# EAGLE design RPi-Camera-RingLicht_v10 (EAGLE 7.5.0)
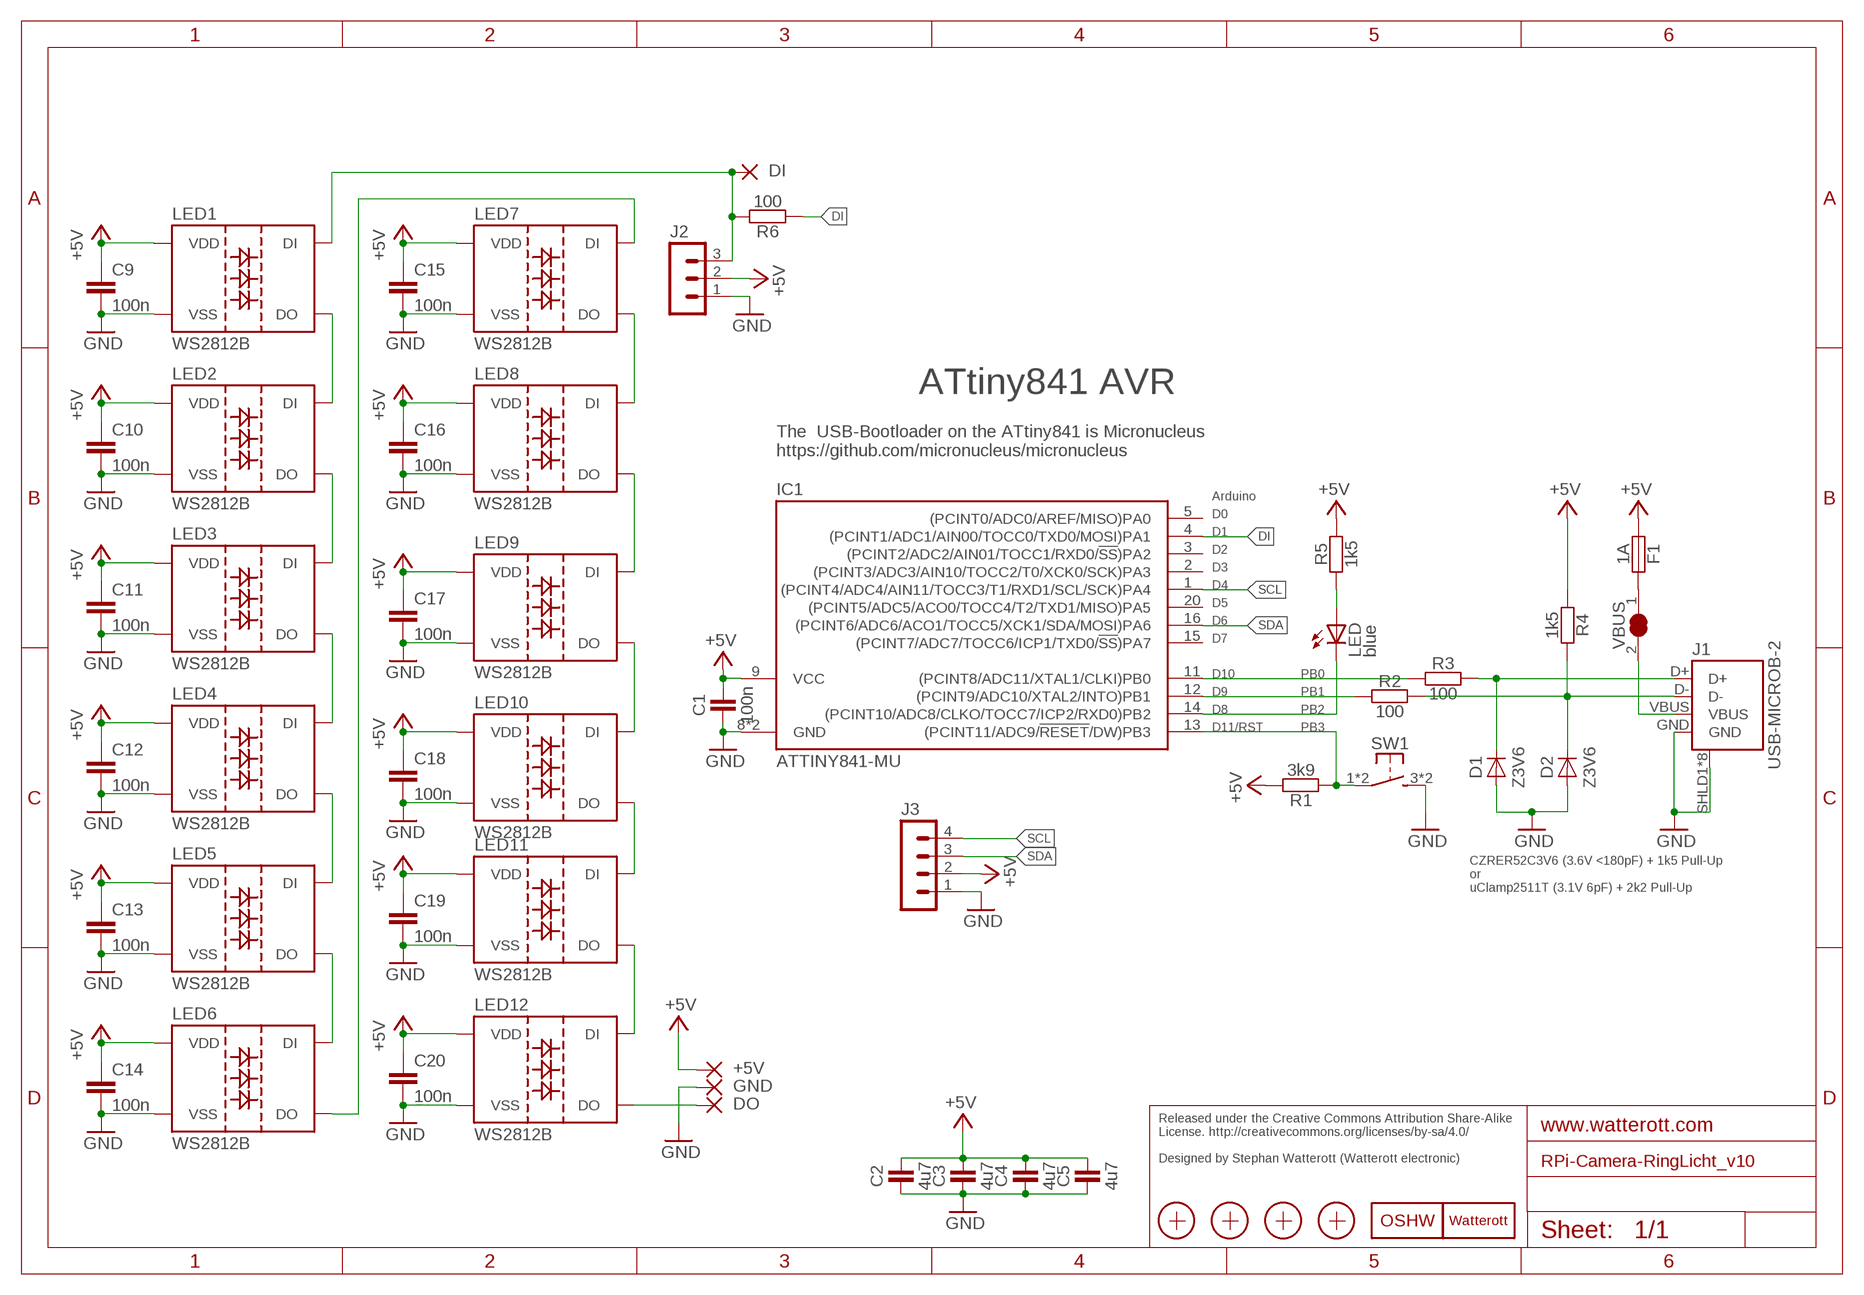
[diagram p0: schematic, sheet 1]

## Parts
+5V  SMD2  [SMD1,27-2,54]
C1  100n  CAPACITOR-0402  [C0402]
C2  4u7  CAPACITOR-0402  [C0402]
C3  4u7  CAPACITOR-0402  [C0402]
C4  4u7  CAPACITOR-0402  [C0402]
C5  4u7  CAPACITOR-0402  [C0402]
C9  100n  C-EUC0402K  [C0402K]
C10  100n  C-EUC0402K  [C0402K]
C11  100n  C-EUC0402K  [C0402K]
C12  100n  C-EUC0402K  [C0402K]
C13  100n  C-EUC0402K  [C0402K]
C14  100n  C-EUC0402K  [C0402K]
C15  100n  C-EUC0402K  [C0402K]
C16  100n  C-EUC0402K  [C0402K]
C17  100n  C-EUC0402K  [C0402K]
C18  100n  C-EUC0402K  [C0402K]
C19  100n  C-EUC0402K  [C0402K]
C20  100n  C-EUC0402K  [C0402K]
D1  Z3V6  DIODE-SOD882  [SOD882]
D2  Z3V6  DIODE-SOD882  [SOD882]
DI  SMD2  [SMD1,27-2,54]
DO  SMD2  [SMD1,27-2,54]
F1  1A  FUSE-0805  [C0805]
GND  SMD2  [SMD1,27-2,54]
IC1  ATTINY841-MU  [QFN20-PAD]
J1  USB-MICROB-2  [USB-MICROB-10118194]
J2  JST3-S3B-PH-SM4-TB  [JST_S3B-PH-SM4-TB]
J3  JST4-S4B-PH-SM4-TB  [JST_S4B-PH-SM4-TB]
LED  blue  LED-0603  [C0603]
LED1  WS2812B  [WS2812B]
LED2  WS2812B  [WS2812B]
LED3  WS2812B  [WS2812B]
LED4  WS2812B  [WS2812B]
LED5  WS2812B  [WS2812B]
LED6  WS2812B  [WS2812B]
LED7  WS2812B  [WS2812B]
LED8  WS2812B  [WS2812B]
LED9  WS2812B  [WS2812B]
LED10  WS2812B  [WS2812B]
LED11  WS2812B  [WS2812B]
LED12  WS2812B  [WS2812B]
LOGO1  LOGO-S_PLACE_M  [SPARK_TPLACE_M]
LOGO2  OSHW_LOGOX0070  [OSHW_6X70]
R1  3k9  RESISTOR-0402  [C0402]
R2  100  RESISTOR-0402  [C0402]
R3  100  RESISTOR-0402  [C0402]
R4  1k5  RESISTOR-0402  [C0402]
R5  1k5  RESISTOR-0402  [C0402]
R6  100  RESISTOR-0402  [C0402]
SW1  SW-TACTILE-PTS840P  [PTS840P]
VBUS  JUMPER2-0603-NC  [JUMPER2-0603_NC]
X1  PASSER-07  [PASSER_07MM]
X2  PASSER-07  [PASSER_07MM]
X3  PASSER-07  [PASSER_07MM]
X4  PASSER-07  [PASSER_07MM]

## Nets
+5V: +5V.1(P) C1.2 C2.2 C3.2 C4.2 C5.2 C9.1 C10.1 C11.1 C12.1 C13.1 C14.1 C15.1 C16.1 C17.1 C18.1 C19.1 C20.1 F1.1 IC1.9(VCC) J2.2 J3.2 LED1.1(VDD) LED2.1(VDD) LED3.1(VDD) LED4.1(VDD) LED5.1(VDD) LED6.1(VDD) LED7.1(VDD) LED8.1(VDD) LED9.1(VDD) LED10.1(VDD) LED11.1(VDD) LED12.1(VDD) R1.2 R4.1 R5.2
D_N: D2.C J1.D- R2.2 R4.2
D_P: D1.C J1.D+ R3.2
DI: IC1.4((PCINT1/ADC1/AIN00/TOCC0/TXD0/MOSI)PA1) R6.1
GND: C1.1 C2.1 C3.1 C4.1 C5.1 C9.2 C10.2 C11.2 C12.2 C13.2 C14.2 C15.2 C16.2 C17.2 C18.2 C19.2 C20.2 D1.A D2.A GND.1(P) IC1.8(GND) IC1.TP(GND) J1.GND J1.SHLD1(SHIELD) J1.SHLD2(SHIELD) J1.SHLD3(SHIELD) J1.SHLD4(SHIELD) J1.SHLD5(SHIELD) J1.SHLD6(SHIELD) J1.SHLD7(SHIELD) J1.SHLD8(SHIELD) J2.1 J3.1 LED1.3(VSS) LED2.3(VSS) LED3.3(VSS) LED4.3(VSS) LED5.3(VSS) LED6.3(VSS) LED7.3(VSS) LED8.3(VSS) LED9.3(VSS) LED10.3(VSS) LED11.3(VSS) LED12.3(VSS) SW1.3(S1) SW1.4(S1)
LED+: LED.A R5.1
N$1: F1.2 VBUS.1
N$46: LED1.2(DO) LED2.4(DI)
N$47: LED2.2(DO) LED3.4(DI)
N$48: LED3.2(DO) LED4.4(DI)
N$49: LED4.2(DO) LED5.4(DI)
N$50: LED5.2(DO) LED6.4(DI)
N$51: LED6.2(DO) LED7.4(DI)
N$52: LED7.2(DO) LED8.4(DI)
N$53: LED9.2(DO) LED10.4(DI)
N$54: LED10.2(DO) LED11.4(DI)
N$55: LED11.2(DO) LED12.4(DI)
N$57: LED8.2(DO) LED9.4(DI)
N$187: DI.1(P) J2.3 LED1.4(DI) R6.2
N$188: DO.1(P) LED12.2(DO)
PB0: IC1.11((PCINT8/ADC11/XTAL1/CLKI)PB0) R3.1
PB1: IC1.12((PCINT9/ADC10/XTAL2/INTO)PB1) R2.1
PB2: IC1.14((PCINT10/ADC8/CLKO/TOCC7/ICP2/RXD0)PB2) LED.C
PB3: IC1.13((PCINT11/ADC9/!RESET!/DW)PB3) R1.1 SW1.1 SW1.2(P1)
SCL: IC1.1((PCINT4/ADC4/AIN11/TOCC3/T1/RXD1/SCL/SCK)PA4) J3.4
SDA: IC1.16((PCINT6/ADC6/ACO1/TOCC5/XCK1/SDA/MOSI)PA6) J3.3
VBUS1: J1.VBUS VBUS.2
Unconnected: IC1.2((PCINT3/ADC3/AIN10/TOCC2/T0/XCK0/SCK)PA3) IC1.3((PCINT2/ADC2/AIN01/TOCC1/RXD0/!SS!)PA2) IC1.5((PCINT0/ADC0/AREF/MISO)PA0) IC1.15((PCINT7/ADC7/TOCC6/ICP1/TXD0/!SS!)PA7) IC1.20((PCINT5/ADC5/ACO0/TOCC4/T2/TXD1/MISO)PA5)

## Notes on the sheet
- ATtiny841 AVR
- The  USB-Bootloader on the ATtiny841 is Micronucleus 
  https://github.com/micronucleus/micronucleus
- Arduino
- D0
- D1
- D2
- D3
- D4
- D5
- D6
- D7
- D10
- D9
- D8
- D11/RST
- CZRER52C3V6 (3.6V <180pF) + 1k5 Pull-Up 
  or
  uClamp2511T (3.1V 6pF) + 2k2 Pull-Up
- Released under the Creative Commons Attribution Share-Alike 
  License. http://creativecommons.org/licenses/by-sa/4.0/
  
  Designed by Stephan Watterott (Watterott electronic)

## Library data of the parts
+5V DI DO GND = wirepad:SMD2: SMD PAD
C1-C5 = we-rcl:CAPACITOR: Capacitors ...2.2uF @ 6.3V -> 0402 ...4.7uF @ 6.3V -> 0603 ...10uF @ 16V -> 0805 ...22uF @ 25V -> 1206
C9-C20 = rcl:C-EU: CAPACITOR, European symbol
D1 D2 = we-rcl:DIODE: Diodes
F1 = we-rcl:FUSE: Fuses
IC1 = we-chip:ATTINY841: Atmel ATtiny441/841 AVR Microcontroller
J1 = we-con:USB: USB Connectors; DIGIKEY: 609-4618-6-ND
J2 = we-con:JST3: JST Connector
J3 = we-con:JST4: JST Connector
LED = we-opto:LED: LEDs red, green, blue -> 0603
LED1-LED12 = WS2812:WS2812B
LOGO1 = we-symbol:LOGO: Watterott electronic Logo
LOGO2 = we-symbol:OSHW_LOGO: Open-Source-Hardware Logo
R1-R6 = we-rcl:RESISTOR: Resistors all kinds in 0402 and 0603
SW1 = we-switch:SW-TACTILE: Tactile Switches; DIGIKEY: CKN10511DKR-ND
VBUS = we-rcl:JUMPER2: 2 Pin Jumpers
X1-X4 = we-symbol:PASSER: Fiducial Markers

## Board
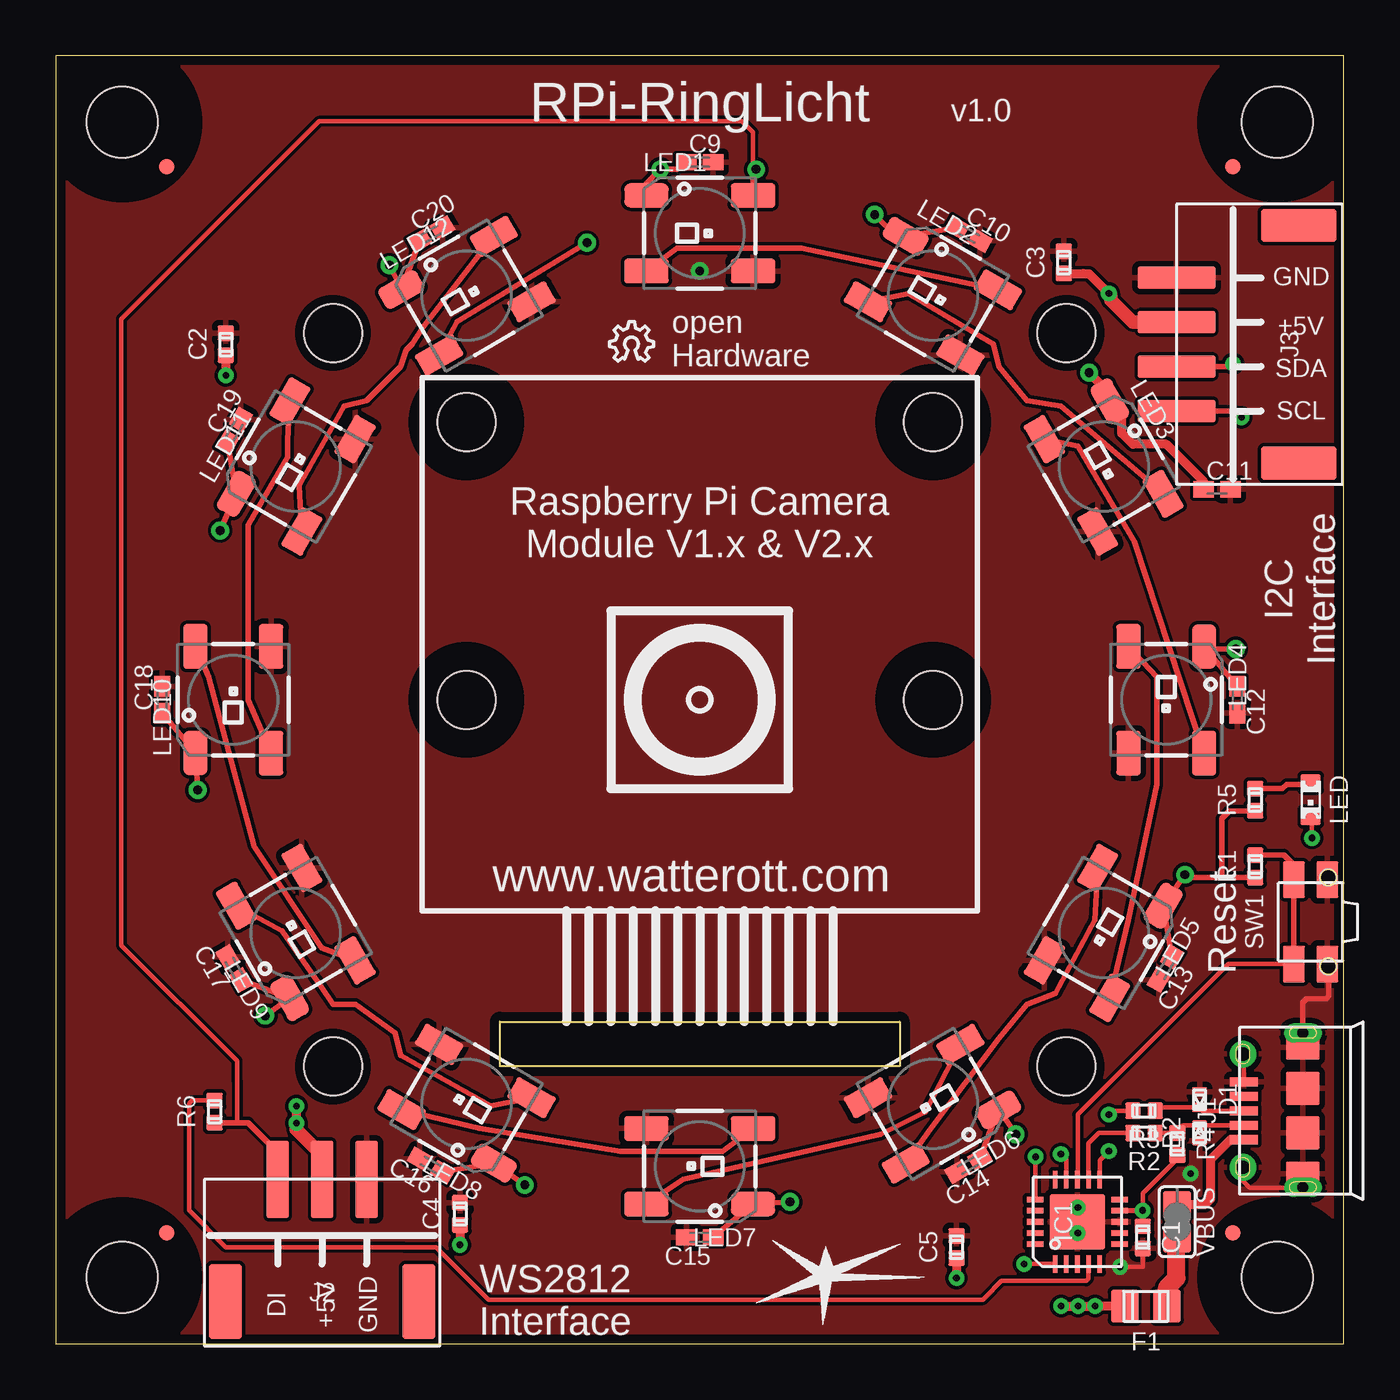
[diagram p1: board, top side]
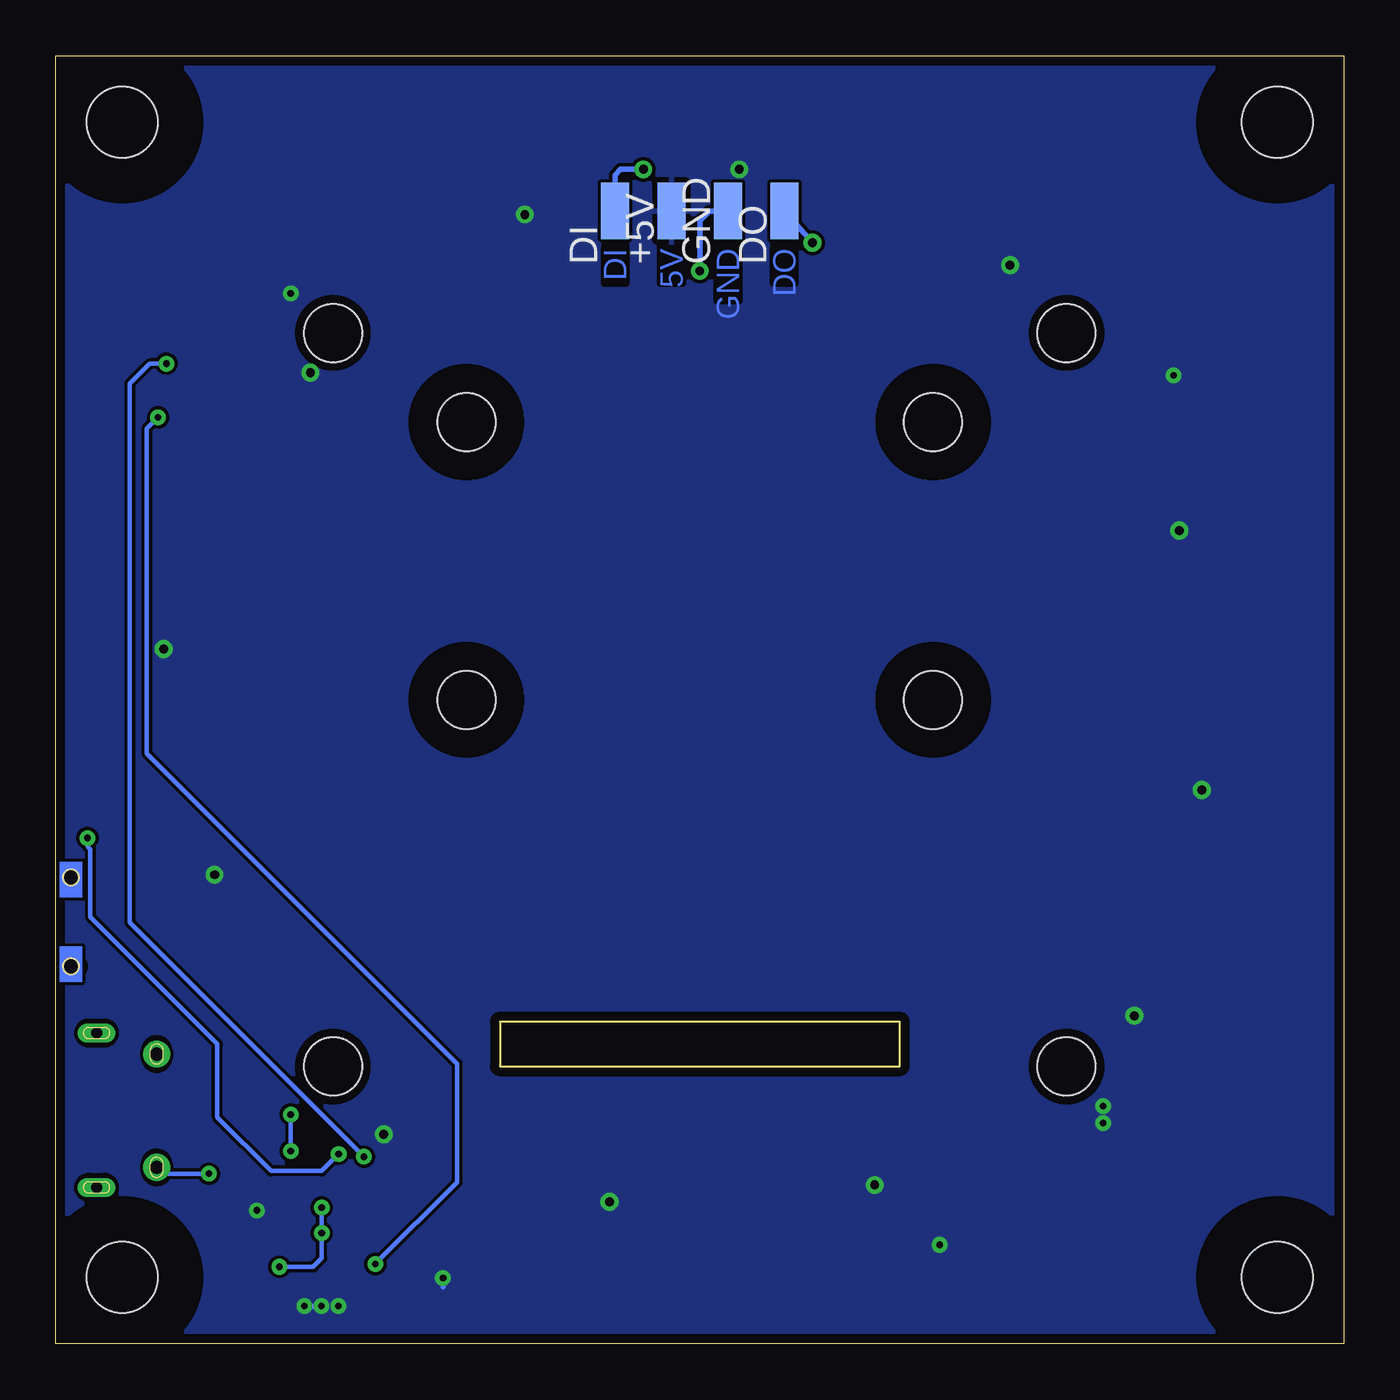
[diagram p2: board, bottom side, seen from below]

Size 58 x 58 mm. Coordinates in mm from the lower left corner, seen from the top.
Outline: 0,0 58,0 58,58 0,58 0,0
Outline: 20,14.5 38,14.5 38,12.5 20,12.5 20,14.5
Copper layers (1*16): Top 0.035mm / dielectric 1.5mm / Bottom 0.035mm
Design rules "we-dru-2-layer": minimum track width 0.15mm, minimum drill 0.3mm, track to track 0.15mm, track to pad 0.15mm, pad to pad 0.15mm, via to via 0.15mm, smd to smd 0.1mm, copper to edge 0.4mm, drill to drill 0.2mm, minimum pad ring 0.18mm, minimum via ring 0.2mm, stop-mask expansion 0.1mm, vias tented up to drill 0.5mm, thermal gap 0.25mm
Holes 3.2 mm at 3,55 55,55 3,3 55,3
Holes 2.6 mm at 12.49,45.51 45.51,45.51 45.51,12.49 12.49,12.49 39.5,29 18.5,29 18.5,41.5 39.5,41.5
tRestrict: area 16,39 to 21,44; area 37,39 to 42,44; area 16,26.5 to 21,31.5; area 37,26.5 to 42,31.5; area -0.5,51.5 to 6.5,58.5; area 51.5,51.5 to 58.5,58.5; area -0.5,-0.5 to 6.5,6.5; area 51.5,-0.5 to 58.5,6.5
bRestrict: area 16,39 to 21,44; area 37,39 to 42,44; area 16,26.5 to 21,31.5; area 37,26.5 to 42,31.5; area -0.5,51.5 to 6.5,58.5; area 51.5,51.5 to 58.5,58.5; area -0.5,-0.5 to 6.5,6.5; area 51.5,-0.5 to 58.5,6.5

### Footprints (pad centres in the part's own frame; a part is rotated, then mirrored left to right if it is on the bottom)
SMD1,27-2,54 = smd 1.27 x 2.54: 1 0,0
C0402 = smd 0.75 x 0.7: 1 0,0.5; 2 0,-0.5
C0402K = smd 0.925 x 0.74: 1 -0.6,0; 2 0.6,0
SOD882 = smd 0.65 x 0.4: A 0,-0.35; C 0,0.35
C0805 = smd 1.5 x 1.25: 1 0,0.95; 2 0,-0.95
QFN20-PAD = smd 0.8 x 0.26: 1 -1.9,1; 2 -1.9,0.5; 3 -1.9,0; 4 -1.9,-0.5; 5 -1.9,-1; 11 1.9,-1; 12 1.9,-0.5; 13 1.9,0; 14 1.9,0.5; 15 1.9,1 | smd 0.26 x 0.8: 6 -1,-1.9; 7 -0.5,-1.9; 8 0,-1.9; 9 0.5,-1.9; 10 1,-1.9; 16 1,1.9; 17 0.5,1.9; 18 0,1.9; 19 -0.5,1.9; 20 -1,1.9 | smd 2.5 x 2.5: TP 0,0
USB-MICROB-10118194 = smd 1.3 x 0.4: D+ -2.5,0; D- -2.5,-0.65; GND -2.5,1.3; ID -2.5,0.65; VBUS -2.5,-1.3 | drill 0.6 pad 1.2: SHLD1 -2.55,2.55; SHLD2 -2.55,-2.55 | drill 0.5 pad 0.8 long: SHLD3 0.15,3.5; SHLD4 0.15,-3.45 | smd 1.5 x 1.1: SHLD5 0.15,2.85; SHLD6 0.15,-2.85 | smd 1.5 x 1.5: SHLD7 0.15,1; SHLD8 0.15,-1
JST_S3B-PH-SM4-TB = smd 3.5 x 1: 1 -3.81,2; 2 -3.81,0; 3 -3.81,-2 | smd 3.4 x 1.5: SHLD1 1.69,4.35; SHLD2 1.69,-4.35
JST_S4B-PH-SM4-TB = smd 3.5 x 1: 1 -1.27,3; 2 -1.27,1; 3 -1.27,-1; 4 -1.27,-3 | smd 3.4 x 1.5: SHLD1 4.23,5.35; SHLD2 4.23,-5.35
C0603 = smd 0.9 x 0.8: A 0,-0.75; C 0,0.75
WS2812B = smd 2 x 1.1: 1 -2.4,1.7; 2 -2.4,-1.7; 3 2.4,-1.7; 4 2.4,1.7
PTS840P = smd 1.65 x 1: 1 -1.9,0.75; 2 1.9,0.75; 3 -1.9,-0.75; 4 1.9,-0.75 | hole 0.7: -2,-0.8; 2,-0.8
JUMPER2-0603_NC = smd 1.25 x 1.25: 1 0,0.76; 2 0,-0.76
PASSER_07MM = smd 0.7 x 0.7: X 0,0

### Placement (x,y rotation side)
+5V  30.27,51 0 bottom
C1  48.94,4.8 180 top
C2  7.66,45 0 top
C3  45.38,48.69 0 top
C4  18.2,5.86 0 top
C5  40.56,4.36 0 top
C9  29,53.2 0 top
C10  41.1,49.96 330 top
C11  52.29,38.48 0 top
C12  53.2,29 270 top
C13  49.96,16.9 240 top
C14  41.1,8.04 210 top
C15  29,4.8 180 top
C16  16.9,8.04 150 top
C17  8.04,16.9 120 top
C18  4.8,29 90 top
C19  8.04,41.1 60 top
C20  16.9,49.96 30 top
D1  51.5,11 180 top
D2  51.5,9.5 0 top
DI  32.81,51 0 bottom
DO  25.19,51 0 bottom
F1  49.08,1.7 90 top
GND  27.73,51 0 bottom
IC1  46,5.5 90 top
J1  56,10.5 0 top
J2  12,3.6 270 top
J3  51.73,45 0 top
LED  56.5,24.5 180 top
LED1  29,50 0 top
LED2  39.5,47.19 330 top
LED3  47.19,39.5 300 top
LED4  50,29 270 top
LED5  47.19,18.5 240 top
LED6  39.5,10.81 210 top
LED7  29,8 180 top
LED8  18.5,10.81 150 top
LED9  10.81,18.5 120 top
LED10  8,29 90 top
LED11  10.81,39.5 60 top
LED12  18.5,47.19 30 top
LOGO1  34.72,3.09 0 top
LOGO2  24.94,44.24 0 top
R1  54,21.5 0 top
R2  49,9.5 90 top
R3  49,10.5 90 top
R4  50.5,9 180 top
R5  54,24.5 0 top
R6  7.16,10.46 0 top
SW1  56.5,19 90 top
VBUS  50.49,5.5 180 top
X1  5,5 0 top
X2  53,5 0 top
X3  53,53 0 top
X4  5,53 0 top

### Tracks (layer width: path | path; a pad name or v marks a point on that pad's centre or on a via)
+5V  (via drill 0.3, 0.4)
  Top 0.203: LED3.1 47.46,42.8 | v48.94,6.01 47.91,6.01 IC1.9 48.93,6 v48.94,6.01 | C1.2 48.94,5.76 v48.94,6.01 | v48.94,6.01 48.94,6.77 50.46,8.3 50.46,8.46 R4.1
  Top 0.254: C9.1 28.31,53.2 27.98,52.88 v27.22,52.88 26.6,52.25 LED1.1 | v36.87,50.84 37.86,49.86 LED2.1 C10.1 | v15.03,48.56 LED12.1 C20.1 | v7.41,36.62 LED11.1 C19.1 | v6.39,24.94 LED10.1 C18.1 | v9.44,14.78 LED9.1 C17.1 | v21.13,7.16 LED8.1 C16.1 | v33.06,6.39 LED7.1 C15.1 | v43.22,9.44 42.72,10.2 LED6.1 C14.1 | v53.13,31.29 51.92,31.29 51.86,31.22 LED4.1 C12.1 | C13.1 LED5.1 v50.84,21.13 50.97,21 52.5,21 | R1.2 52.5,21 | R5.2 52.83,24 52.5,23.67 52.5,21 | 46.26,48.19 46.27,48.18
  Top 0.406: 47.46,42.8 v46.53,43.73 | C2.2 v7.66,43.61 | C3.2 46.26,48.19 | 46.27,48.18 46.53,48.18 v47.41,47.29 47.56,47.14 | C5.2 v40.56,2.96 | F1.1 v46.8,1.7 v45.27,1.7 | v10.84,10.71 v10.84,9.95 | C4.2 v18.2,4.46 | C11.1 51.69,38.81 50,40.5 48.5,40.5 48,41 48,41.89
  Top 0.61: v10.84,9.95 10.84,9.66 12,8.5 J2.2 | J3.2 48.5,46 47.5,47 47.5,47.2 v47.41,47.29 | 48,41.89 LED3.1
  Bottom 0.203: v48.94,6.01 48.94,6.27
  Bottom 0.254: v40.56,2.96 40.56,2.58 | v46.8,1.7 v46.03,1.7
  pour Bottom: 0,0 58,0 58,58 0,58
D_N
  Top 0.203: J1.D- D2.C 50.85,9.85 arc90 R4.2 R2.2
D_P
  Top 0.203: J1.D+ 51.65,10.5 arc-90 D1.C 49.65,10.65 arc90 R3.2
DI
  Top 0.2: 15.66,4.36 17.14,4.36 19.5,2 41.75,2 41.83,2.08
  Top 0.203: IC1.4 46.5,2.94 46.4,2.84 42.59,2.84 41.83,2.08 | 15.66,4.36 7.66,4.36 6.01,6.01 6.01,10.84 6.14,10.97 7.15,10.97 R6.1
GND  (via drill 0.3, 0.4)
  Top 0.203: J1.GND 53.5,13 J1.SHLD1 | J1.SHLD3 J1.SHLD5 | J1.SHLD6 J1.SHLD4 56.13,7.03 53.77,7.03 53.45,7.34 J1.SHLD2 | C1.1 48.94,3.47 v47.92,3.47 | v46.02,6.14 46.02,5.52 IC1.TP
  Top 0.254: J1.SHLD3 56.15,15.38 56.3,15.54 57.19,15.54 57.32,15.66 57.32,17.03 SW1.3
  Bottom 0.2: 46.02,3.85 v46.02,6.14
  Bottom 0.203: v51.1,7.66 53.16,7.66 J1.SHLD2 | v47.92,3.47 46.4,3.47 46.02,3.85
  Bottom 0.254: GND.1 28.59,51 29,50.59 v29,48.3
  other vias: 46.02,5
  pour Top: 0,0 58,0 58,58 0,58
LED+
  Top 0.254: R5.1 55.23,25 55.42,25.19 56.44,25.19 LED.A
N$1
  Top 0.813: F1.2 50.03,2.53 50.46,2.96 50.46,4.71 VBUS.1
N$2
  Top 0.406: 50.46,4.74 50.46,6.14
N$46
  Top 0.254: LED2.4 33.57,49.32 27.98,49.32 LED1.2
N$47
  Top 0.254: LED2.2 38.4,47.29 42.21,45 42.46,43.99 43.73,42.46 45.26,42.21 LED3.4
N$48
  Top 0.254: LED4.4 48.56,36.11 46.02,40.43 LED3.2
N$49
  Top 0.254: LED5.4 48.3,19.09 49.57,25.19 49.57,30.02 LED4.2
N$50
  Top 0.254: LED6.4 39.41,9.7 42.46,13.76 43.73,15.28 45,15.79 46.78,19.09 LED5.2
N$51
  Top 0.254: LED7.4 28.24,7.41 37.13,9.44 39.16,10.46 LED6.2
N$52
  Top 0.254: LED8.4 19.09,9.7 25.44,8.68 30.02,8.68 LED7.2
N$53
  Top 0.254: LED10.4 6.9,30.02 8.93,22.4 11.98,17.82 LED9.2
N$54
  Top 0.254: LED11.4 10.46,40.68 10.46,39.92 8.68,36.87 8.68,29 LED10.2
N$55
  Top 0.254: 10.97,36.69 LED11.2 10.97,38.65 13,42.21 14.01,42.46 15.54,43.99 15.79,44.75 16.05,45 16.55,45.76 LED12.4
N$57
  Top 0.254: LED9.4 10.2,18.59 11.98,16.05 12.49,15.28 13.51,15.28 15.28,14.01 15.54,13 19.6,10.71 LED8.2
N$187  (via drill 0.4)
  Top 0.203: LED1.4 31.4,54.54 30.91,55.03 11.86,55.03 2.96,46.14 2.96,17.95 8.17,12.74 8.17,11.86 8.17,9.95 7.92,9.95
  Top 0.254: LED1.4 31.4,52.74 v31.54,52.88 | R6.2 7.92,9.95 8.68,9.95 10,8.63 J2.3
  Bottom 0.254: v31.54,52.88 32.56,52.88 32.81,52.62 DI.1
N$188  (via drill 0.4)
  Top 0.254: v23.92,49.57 18.08,46.02 LED12.2
  Bottom 0.254: DO.1 v23.92,49.57
PB0  (via drill 0.3)
  Top 0.2: IC1.11 47,8.27 v47.41,8.68
  Top 0.203: R3.1 47.58,10.5 arc90 v47.41,10.33
  Bottom 0.203: v47.41,10.33 v47.41,8.68
PB1
  Top 0.2: R2.1 46.97,9.5 46.5,9.04 IC1.12
PB2  (via drill 0.3)
  Top 0.203: IC1.14 45.5,8.31 v45.26,8.55 | v56.56,22.78 56.56,23.69 LED.C
  Bottom 0.2: v56.56,22.78 56.56,22.4 56.43,22.27 56.43,19.22 50.72,13.51
  Bottom 0.203: v45.26,8.55 46.02,7.79 48.3,7.79 50.72,10.2 50.72,13.51
PB3
  Top 0.203: SW1.1 52.79,17.1 46.02,10.33 46.02,7.42 IC1.13
  Top 0.254: SW1.1 SW1.2 55.75,21.55 55.29,22.02 54.02,22.02 R1.1
SCL  (via drill 0.3)
  Top 0.203: v43.61,3.6 IC1.1
  Top 0.254: J3.4 53.1,42 v53.38,41.72
  Bottom 0.203: v53.38,41.72 53.89,41.21 53.89,26.59 39.92,12.62 39.92,7.28 v43.61,3.6
SDA  (via drill 0.3)
  Top 0.203: 52.99,44.14 v53,44.13 | v44.11,8.43 44.11,6.51 IC1.16
  Top 0.254: J3.3 52.87,44 v53,44.13
  Bottom 0.203: v53,44.13 53.77,44.13 54.65,43.24 54.65,18.97 v44.11,8.43
VBUS1
  Top 0.406: J1.VBUS 52.89,9.2 51.99,8.3 51.99,6.52 51.73,6.27 51.01,6.27 VBUS.2

### Text on the board
Bottom: DO | GND | 5V | DI
tPlace: RPi-RingLicht | v1.0 | GND | +5V | open / Hardware | SDA | SCL | Raspberry Pi Camera / Module V1.x & V2.x | I2C / Interface | www.watterott.com | Reset | DI | +5V | GND | WS2812 / Interface
Reference: Silkscreen: 21 tPlace